# Altium schematic sheet mcu_power.SchDoc
size A4
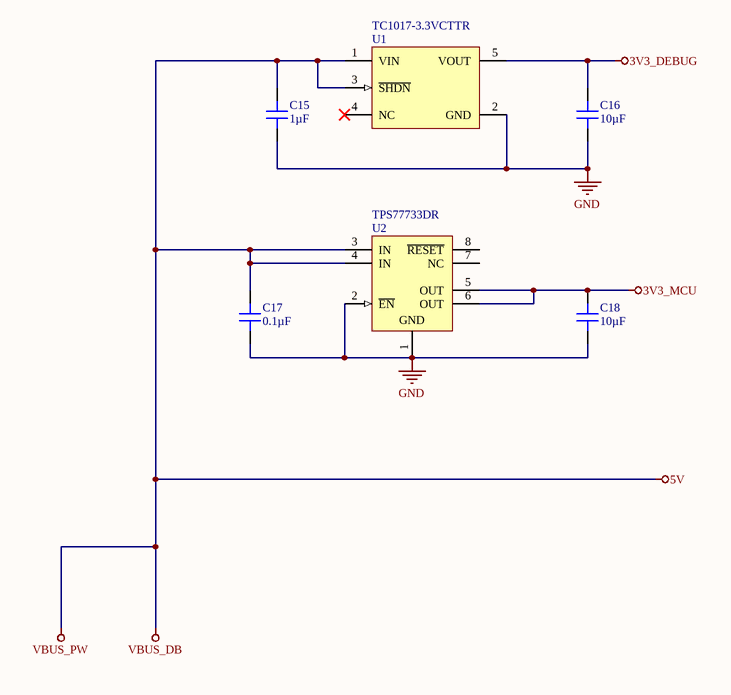
[diagram p0: mcu_power.SchDoc]

## Parts
C15  1µF  [CAP 0603_1608]
C16  10µF  [CAP 0603_1608]
C17  0.1µF  [CAP 0603_1608]
C18  10µF  [CAP 0603_1608]
U1  TC1017-3.3VCTTR  [SOT-23-CT5_L]
U2  TPS77733DR  [D0008A_N]

## Nets
3V3_DEBUG: C16.2 U1.5(VOUT)
3V3_MCU: C18.2 U2.5(OUT) U2.6(OUT)
5V: C15.2 C17.2 U1.1(VIN) U1.3(~{SHDN}) U2.3(IN) U2.4(IN)  [also labelled VBUS_DB, VBUS_PW]
GND: C15.1 C16.1 C17.1 C18.1 U1.2(GND) U2.1(GND) U2.2(~{EN})

Not connected (* = marked no-connect by the designer): U1 4(NC)*; U2 7(NC) 8(~{RESET})

## Library data of the parts
C15 = C0603X105M4RACAUTO: CAP CER 0603 1UF 16V X7R 20%; Manufacturer: KEMET; Part Number: C0603X105M4RACAUTO; Value: 1µF; Applications: Automotive, Boardflex Sensitive; Capacitance: 1µF; ComponentLink1Description: Datasheet; ComponentLink1URL: https://api.kemet.com/component-edge/download/datasheet/C0603X105M4RACAUTO.pdf; ComponentLink2Description: DigiKey Link; ComponentLink2URL: http://digikey.com/product-detail/en/kemet/C0603X105M4RACAUTO/399-17719-1-ND/8635870; Device Package: 0603 (1608 Metric); Features: Soft Termination; LastUpdated: 02.09.2020 1:03:33; Lifecycle Status: Active; Minimum Order: 1; Mounting Type: Surface Mount, MLCC; Operating Temperature: -55°C ~ 125°C; Package / Case: 0603 (1608 Metric); Packaging: TapeAndReel; PartId: 3927; Part Status: Active; Price: 0.07; Ratings: AEC-Q200; Series: SMD Auto X7R Flex; Size / Dimension: 0.063" L x 0.031" W (1.60mm x 0.80mm); Supplier 1: DigiKey; Supplier Part Number 1: 399-17719-1-ND; Temperature Coefficient: X7R; Thickness (Max): 0.037" (0.95mm); Tolerance: ±20%; Voltage - Rated: 16V
C16 C18 = GRT188R61C106KE13D: CAP CER 10UF 16V X5R 0603; Manufacturer: Murata Electronics; Tolerance: ±10%; Part Number: GRT188R61C106KE13D; Value: 10µF; Applications: Automotive; Capacitance: 10µF; ComponentLink1Description: Datasheet; ComponentLink1URL: https://search.murata.co.jp/Ceramy/image/img/A01X/G101/ENG/GRT188R61C106KE13-01.pdf; ComponentLink2Description: DigiKey Link; ComponentLink2URL: http://digikey.com/product-detail/en/murata-electronics/GRT188R61C106KE13D/490-12317-1-ND/5417018; Device Package: 0603 (1608 Metric); LastUpdated: 02.09.2020 1:03:11; Lifecycle Status: Active; Minimum Order: 1; Mounting Type: Surface Mount, MLCC; Operating Temperature: -55°C ~ 85°C; Package / Case: 0603 (1608 Metric); Packaging: TapeAndReel; PartId: 14922; Part Status: Active; Price: 0.10; Ratings: AEC-Q200; Series: GRT; Size / Dimension: 0.063" L x 0.031" W (1.60mm x 0.80mm); Supplier 1: DigiKey; Supplier Part Number 1: 490-12317-1-ND; Temperature Coefficient: X5R; Thickness (Max): 0.035" (0.90mm); Voltage - Rated: 16V
C17 = CS0603KRX7R7BB104: CAP CER 0.1UF 16V X7R 0603; Manufacturer: Yageo; Tolerance: ±10%; Part Number: CS0603KRX7R7BB104; Value: 0.1µF; Applications: Boardflex Sensitive; Capacitance: 0.1µF; ComponentLink1Description: Datasheet; ComponentLink1URL: http://www.yageo.com/NewPortal/yageodocoutput?fileName=/pdf/MLCC/UPY-ST_NPOX7R_16V-to-3KV_5.pdf; ComponentLink2Description: DigiKey Link; ComponentLink2URL: http://digikey.com/product-detail/en/yageo/CS0603KRX7R7BB104/311-3560-1-ND/7648487; Device Package: 0603 (1608 Metric); Features: Soft Termination; LastUpdated: 02.09.2020 1:03:36; Lifecycle Status: Active; Minimum Order: 1; Mounting Type: Surface Mount, MLCC; Operating Temperature: -55°C ~ 125°C; Package / Case: 0603 (1608 Metric); Packaging: TapeAndReel; PartId: 2286; Part Status: Active; Price: 0.02; Series: CS; Size / Dimension: 0.063" L x 0.031" W (1.60mm x 0.80mm); Supplier 1: DigiKey; Supplier Part Number 1: 311-3560-1-ND; Temperature Coefficient: X7R; Thickness (Max): 0.037" (0.95mm); Voltage - Rated: 16V
U1 = CMP-0136-00743-1: 150 mA, Tiny CMOS LDO with Shutdown, 5-Pin SOT-23, Extended Temperature, Tape and Reel; Code_IPC: SOT23-5; PackageVersion: revBB, Aug-2009; PackageDescription: 5-Lead Plastic Small Outline Transistor (CT) [SOT-23]; DatasheetVersion: revD, 2005; PackageReference: SOT-23-CT5
U2 = CMP-0395-00062-2: Single Output Fast Transient Response LDO, 750 mA, Fixed 3.3 V Output, 2.7 to 10 V Input, 8-pin SOIC (D), -40 to 125 degC, Green (RoHS & no Sb/Br); Manufacturer: Texas Instruments; Fixed Output Options(V): 3.3; Vin(Max)(V): 10; Vin(Min)(V): 2.7; Iout(Max)(A): 0.75; Iq(Typ)(mA): 0.08; Vdo(Typ)(mV): 260; SubFamily: Single Channel LDO; Accuracy(%): 2; Eco-Plan: Green (RoHS & no Sb/Br); ComponentLink1Description: Manufacturer URL; DatasheetVersion: SLVS230G; PackageVersion: 4040047-3/M; PackageReference: D0008A; ComponentLink2URL: http://www.ti.com/general/docs/lit/getliterature.tsp?genericPartNumber=TPS77733&fileType=pdf; PartNumber: TPS77733DR; ComponentLink3Description: Package Specification; Mounting Technology: Surface Mount; ComponentLink2Description: Datasheet; ComponentLink3URL: http://www.ti.com/litv/pdf/msoi002j; Vout Adj(Max)(V): 3.3; Code_JEDEC: MS-012; Vout Adj(Min)(V): 3.3; PackageDescription: 8-Pin Plastic Small Outline, Body 4.9 x 3.9 mm, Pitch 1.27 mm; ComponentLink1URL: http://www.ti.com/